# Altium schematic sheet Audio Devices.SchDoc
size A3; Company Name: Renesas Electronics America; CompanyURL: www.renesas.com; PageSetup: Record=PageOptions|CenterHorizontal=True|CenterVertical=True|PrintScale=1.00|XCorrection=1.00|YCorrection=1.00|PrintKind=1|BorderSize=5000000|LeftOffset=0|BottomOffset=0|Orientation=2|PaperLength=1000|PaperWidth=1000|Scale=100|PaperSource=7|PrintQuality=-4|MediaType=1|DitherType=10|PaperKind=A5 148x210mm|PrintScaleMode=1; ReleaseDate: 16.09.2025; Version: MP; SheetNumber: 18; SheetTotal: 18; VariantNumber: 0; DSheetNumber: 1
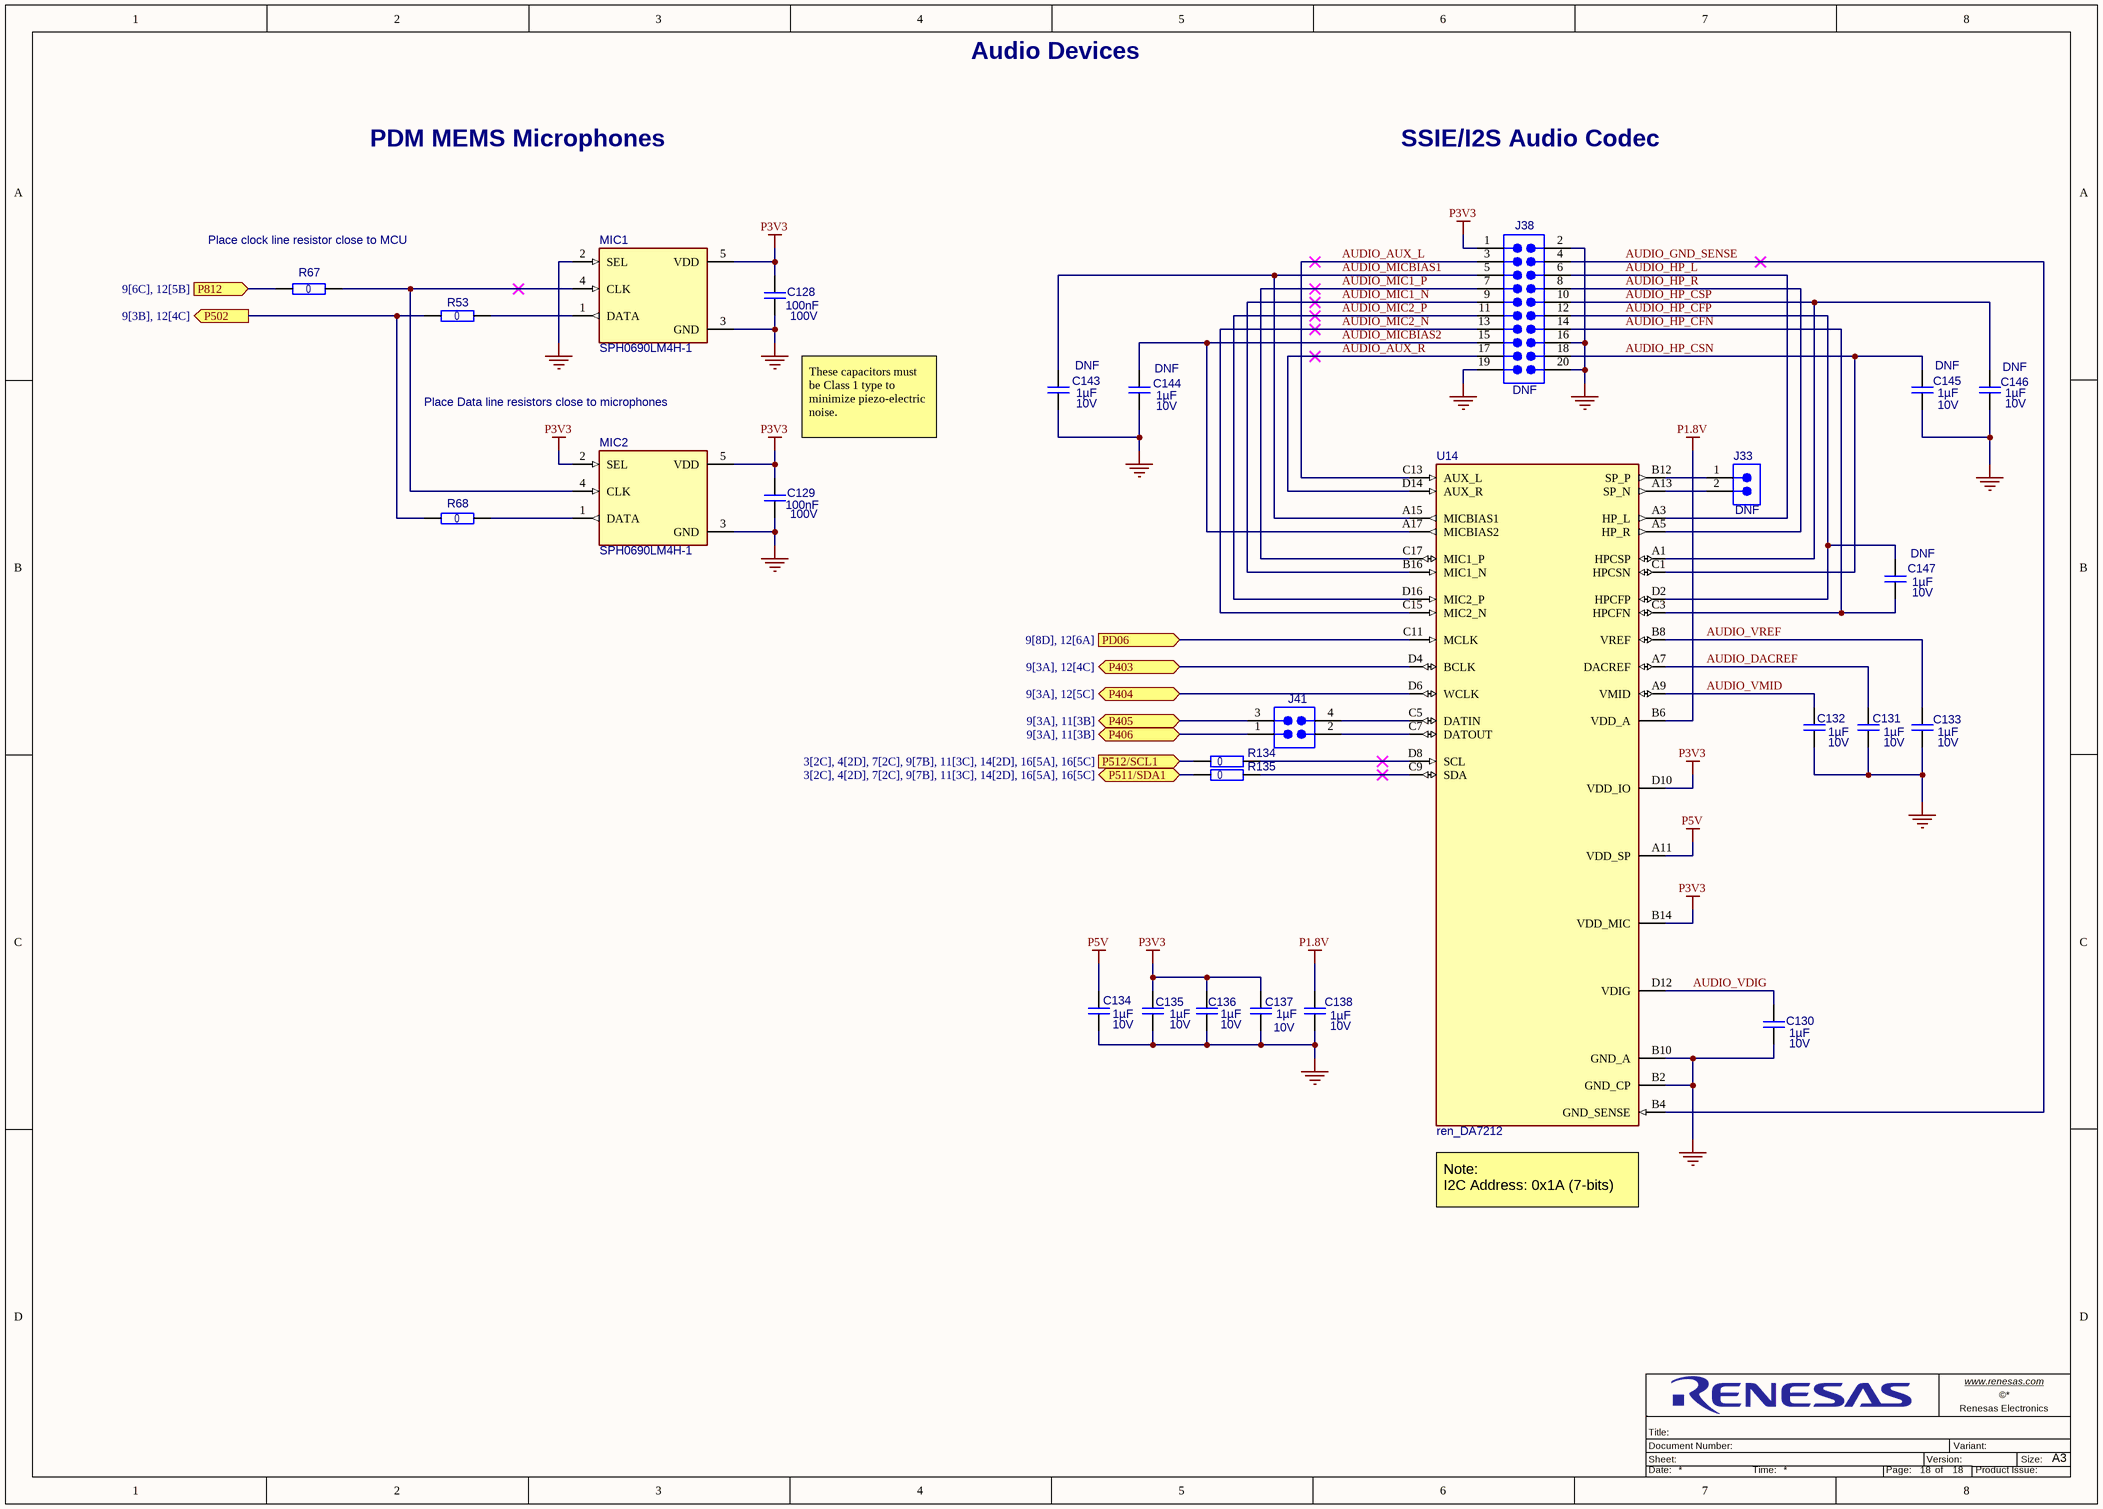
[diagram p0: Audio Devices.SchDoc]

## Parts
C128  value 100nF  Operating Voltage Max: 100V  [C_EIA1206_1p8]  (hidden comment: Capacitor)
C129  value 100nF  Operating Voltage Max: 100V  [C_EIA1206_1p8]  (hidden comment: Capacitor)
C130  value 1µF  Operating Voltage Max: 10V  [C_EIA0201_0p4]  (hidden comment: Capacitor)
C131  value 1µF  Operating Voltage Max: 10V  [C_EIA0201_0p4]  (hidden comment: Capacitor)
C132  value 1µF  Operating Voltage Max: 10V  [C_EIA0201_0p4]  (hidden comment: Capacitor)
C133  value 1µF  Operating Voltage Max: 10V  [C_EIA0201_0p4]  (hidden comment: Capacitor)
C134  value 1µF  Operating Voltage Max: 10V  [C_EIA0201_0p4]  (hidden comment: Capacitor)
C135  value 1µF  Operating Voltage Max: 10V  [C_EIA0201_0p4]  (hidden comment: Capacitor)
C136  value 1µF  Operating Voltage Max: 10V  [C_EIA0201_0p4]  (hidden comment: Capacitor)
C137  value 1µF  Operating Voltage Max: 10V  [C_EIA0201_0p4]  (hidden comment: Capacitor)
C138  value 1µF  Operating Voltage Max: 10V  [C_EIA0201_0p4]  (hidden comment: Capacitor)
C143  value 1µF  Operating Voltage Max: 10V  [C_EIA0201_0p4]  (hidden comment: Capacitor)
C144  value 1µF  Operating Voltage Max: 10V  [C_EIA0201_0p4]  (hidden comment: Capacitor)
C145  value 1µF  Operating Voltage Max: 10V  [C_EIA0201_0p4]  (hidden comment: Capacitor)
C146  value 1µF  Operating Voltage Max: 10V  [C_EIA0201_0p4]  (hidden comment: Capacitor)
C147  value 1µF  Operating Voltage Max: 10V  [C_EIA0201_0p4]  (hidden comment: Capacitor)
J33  CON_002  [wue_61300211121]  (value not drawn)
J38  62002021121  [wue_62002021121]  (value not drawn)
J41  57202-G52-02ALF  [amp_57202-G52-02ALF]  (value not drawn)
MIC1  SPH0690LM4H-1  [knw_LGA_3.5x2.65]
MIC2  SPH0690LM4H-1  [knw_LGA_3.5x2.65]
R53  value 0  [R_EIA0402]  (hidden comment: Resistor)
R67  value 0  [R_EIA0402]  (hidden comment: Resistor)
R68  value 0  [R_EIA0402]  (hidden comment: Resistor)
R134  value 0  [R_EIA0402]  (hidden comment: Resistor)
R135  value 0  [R_EIA0402]  (hidden comment: Resistor)
U14  ren_DA7212  [ren_34-ball-WL-CSP]

## Ports
P403 (bidir, see 9[3A], 12[4C]), P404 (bidir, see 9[3A], 12[5C]), P405 (bidir, see 9[3A], 11[3B]), P406 (bidir, see 9[3A], 11[3B]), P502 (out, see 9[3B], 12[4C]), P511/SDA1 (bidir, see 3[2C], 4[2D], 7[2C], 9[7B], 11[3C], 14[2D], 16[5A], 16[5C]), P512/SCL1 (in, see 3[2C], 4[2D], 7[2C], 9[7B], 11[3C], 14[2D], 16[5A], 16[5C]), P812 (in, see 9[6C], 12[5B]), PD06 (in, see 9[8D], 12[6A])

## Nets
GND: C128.2 C129.2 C130.2 C131.2 C132.2 C133.2 C134.2 C135.2 C136.2 C137.2 C138.2 C143.2 C144.2 C145.2 C146.2 J38.2 J38.16 J38.19 J38.20 MIC1.2(SEL) MIC1.3(GND) MIC2.3(GND) U14.B2(GND_CP) U14.B10(GND_A)
P1.8V: C138.1 U14.B6(VDD_A)
P3V3: C128.1 C129.1 C135.1 C136.1 C137.1 J38.1 MIC1.5(VDD) MIC2.2(SEL) MIC2.5(VDD) U14.B14(VDD_MIC) U14.D10(VDD_IO)
P5V: C134.1 U14.A11(VDD_SP)
AUDIO_AUX_L: J38.3 U14.C13(AUX_L)
AUDIO_AUX_R: J38.17 U14.D14(AUX_R)
AUDIO_DACREF: C131.1 U14.A7(DACREF)
AUDIO_GND_SENSE: J38.4 U14.B4(GND_SENSE)
AUDIO_HP_CFN: C147.2 J38.14 U14.C3(HPCFN)
AUDIO_HP_CFP: C147.1 J38.12 U14.D2(HPCFP)
AUDIO_HP_CSN: C145.1 J38.18 U14.C1(HPCSN)
AUDIO_HP_CSP: C146.1 J38.10 U14.A1(HPCSP)
AUDIO_HP_L: J38.6 U14.A3(HP_L)
AUDIO_HP_R: J38.8 U14.A5(HP_R)
AUDIO_MIC1_N: J38.9 U14.B16(MIC1_N)
AUDIO_MIC1_P: J38.7 U14.C17(MIC1_P)
AUDIO_MIC2_N: J38.13 U14.C15(MIC2_N)
AUDIO_MIC2_P: J38.11 U14.D16(MIC2_P)
AUDIO_MICBIAS1: C143.1 J38.5 U14.A15(MICBIAS1)
AUDIO_MICBIAS2: C144.1 J38.15 U14.A17(MICBIAS2)
AUDIO_VDIG: C130.1 U14.D12(VDIG)
AUDIO_VMID: C132.1 U14.A9(VMID)
AUDIO_VREF: C133.1 U14.B8(VREF)
P403: U14.D4(BCLK) ; port P403
P404: U14.D6(WCLK) ; port P404
P405: J41.3 ; port P405
P406: J41.1 ; port P406
P502: R53.1 R68.1 ; port P502
P511/SDA1: R135.2 ; port P511/SDA1
P512/SCL1: R134.2 ; port P512/SCL1
P812: R67.1 ; port P812
PD06: U14.C11(MCLK) ; port PD06
NetJ33_1: J33.1 U14.B12(SP_P)
NetJ33_2: J33.2 U14.A13(SP_N)
NetJ41_2: J41.2 U14.C7(DATOUT)
NetJ41_4: J41.4 U14.C5(DATIN)
NetMIC1_1: MIC1.1(DATA) R53.2
NetMIC1_4: MIC1.4(CLK) MIC2.4(CLK) R67.2
NetMIC2_1: MIC2.1(DATA) R68.2
NetR134_1: R134.1 U14.D8(SCL)
NetR135_1: R135.1 U14.C9(SDA)

## Notes on the sheet
- Audio Devices
- PDM MEMS Microphones
- SSIE/I2S Audio Codec
- (near R67) Place clock line resistor close to MCU
- Place Data line resistors close to microphones
- These capacitors must be Class 1 type to minimize piezo-electric noise.
- (near U14) Note:
  I2C Address: 0x1A (7-bits)
- www.renesas.com <http://www.renesas.com>
- Sheet:
- Title:
- Document Number:
- Version:
- Variant:
- Renesas Electronics
- Size:
- A3
- Date:
- Time:
- Page:
- of
- Product Issue:

## Library data of the parts
C128 C129 = CAP-00000010-3: Capacitor,EIA1206,100n,100V,C0G; Tolerance: 5%; Qualification: AEC-Q200; Subtype: MLCC; Dielectric: C0G; Height: 1.8mm; Operating Temperature Max: 125°C; Operating Temperature Min: -55°C
C130-C138 C143-C147 = CAP-00000011-4: Capacitor,EA0201,1u,10V,X6S; Tolerance: 20%; Qualification: AEC-Q200; Subtype: MLCC; Dielectric: X6S; Height: 390µm; Operating Temperature Max: 105°C; Operating Temperature Min: -55°C
  C143-C147: DNF: DNF
J33 = CON-00003283-14: Header,2way,1row,vertical,2.54mm,THT; Current: 3A; DC Resistance: 20m; Gender: male; Operating Voltage Max: 250V; Height: 8.89mm; Operating Temperature Max: 105°C; Operating Temperature Min: -40°C; Pin Count: 2; Qualification: -; DNF: DNF
J38 = CON-00000115-3: Header,20way,2row,vertical,2.00mm,THT; DC Resistance: 20m; Operating Voltage Max: 200V; Gender: male; Current: 2A; Operating Temperature Min: -40°C; Pin Count: 20; Height: 6.45mm; Operating Temperature Max: 105°C; Qualification: -; DNF: DNF
J41 = CON-00000063-4: Header,4way,2row,vertical,2mm,SMD; Current: 2A; Operating Voltage Max: 200V; Gender: male; DC Resistance: 20m; Operating Temperature Min: -55°C; Pin Count: 4; Height: 6.83mm; Qualification: -; Operating Temperature Max: 125°C
MIC1 MIC2 = ICS-00000023-7: Multimode Digital Bottom Port Silicon Digital Microphone with a single bit PDM output; Operating Voltage Max: 3.6V; Operating Voltage Min: 1.65V; Subtype: Sensor; Operating Temperature Max: 100°C; Operating Temperature Min: -40°C; Pin Count: 5; Qualification: -
R53 R67 R68 R134 R135 = RES-00000801-9: Resistor,EIA0402,0,0.0625W; Power: 62.5mW; Tolerance: 5%; Subtype: Chip Resistor; Operating Temperature Max: 155°C; Operating Temperature Min: -55°C; Qualification: -
U14 = ICS-00000019-7: Ultra-Low Power Stereo Codec; Operating Voltage Max: 5.25V; Operating Voltage Min: 950mV; Subtype: Mixed; Operating Temperature Max: 85°C; Operating Temperature Min: -40°C; Pin Count: 34; Qualification: -